# EAGLE schematic PhatStats Slim Enclosure 2.8 ILI9341 QTPY XIAO PCB v1.0c XPT2406  (EAGLE 7.6.0)
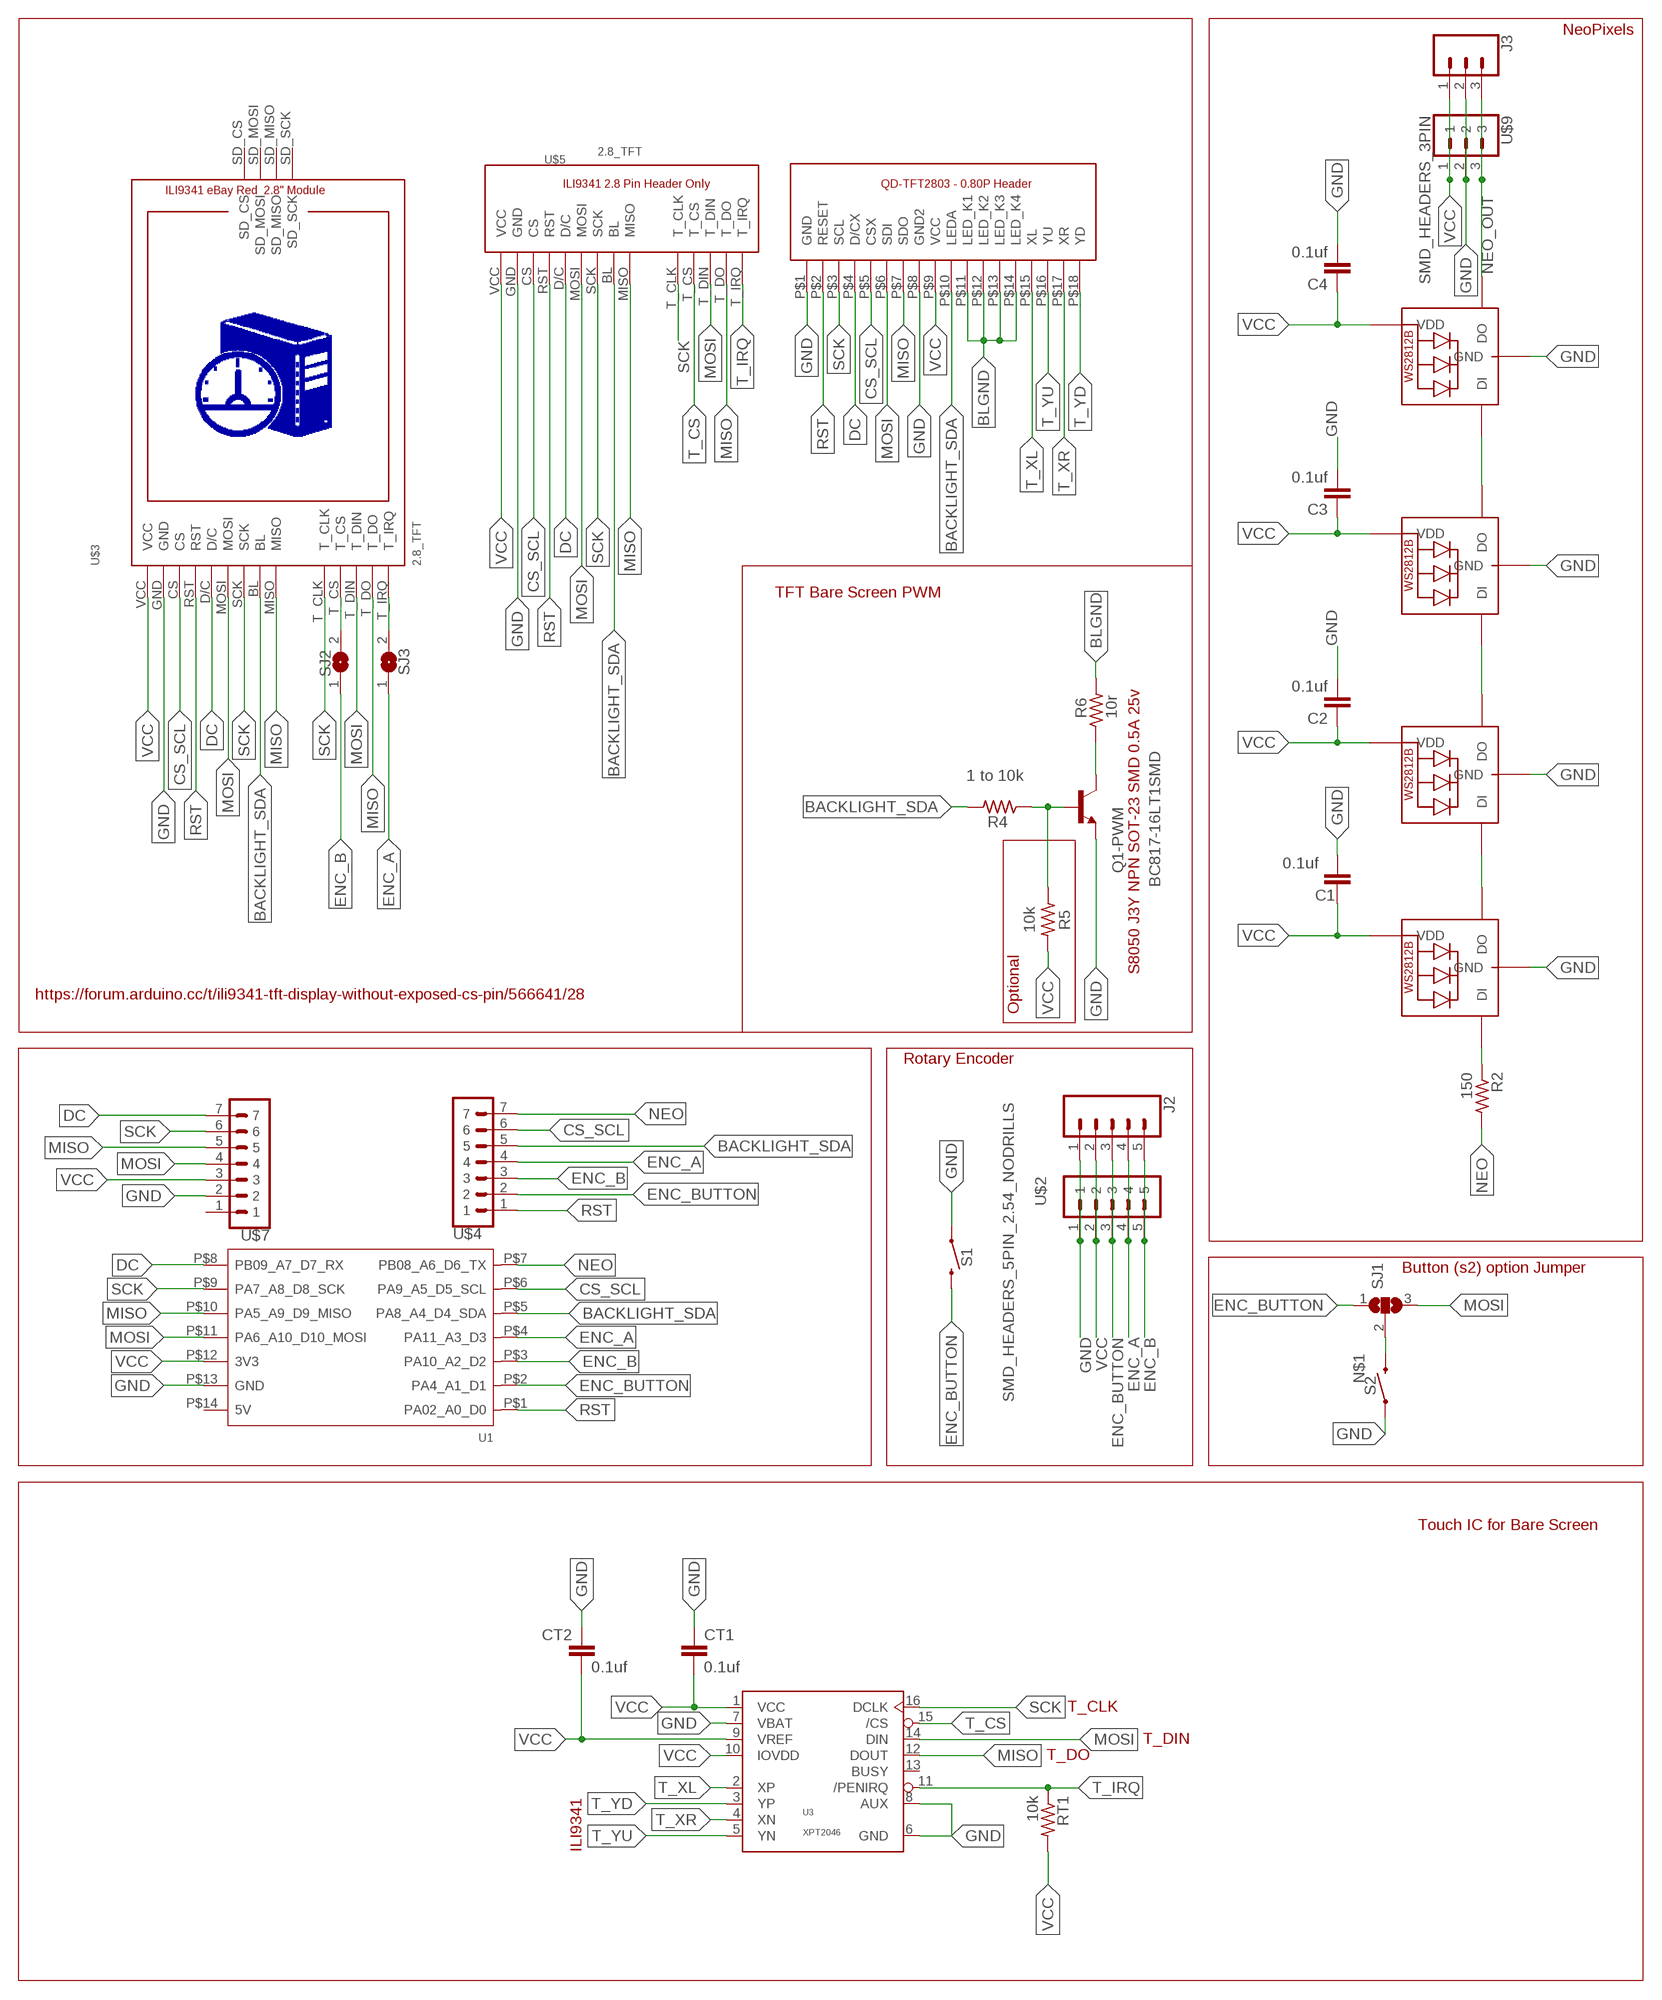
[diagram p0: schematic, sheet 1]

## Parts
0  ILI9341-2.8  [ILI9341-2.8]
C1  0.1uf  C-EUC1206  [C1206]
C2  0.1uf  C-EUC1206  [C1206]
C3  0.1uf  C-EUC1206  [C1206]
C4  0.1uf  C-EUC1206  [C1206]
CT1  0.1uf  C-EUC1206  [C1206]
CT2  0.1uf  C-EUC1206  [C1206]
J2  CONN_05  [1X05]
J3  455-1750-1-ND  CONN_03  [1X03]
NEO0  WS2812B5050  [WS2812B]
NEO1  WS2812B5050  [WS2812B]
NEO2  WS2812B5050  [WS2812B]
NEO3  WS2812B5050  [WS2812B]
Q1-PWM  BC817-16LT1SMD  [SOT23-BEC]
R2  150  R-US_M1206  [M1206]
R4  1 to 10k  R-US_M1206  [M1206]
R5  10k  R-US_M1206  [M1206]
R6  10r  R-US_M1206  [M1206]
RT1  10k  R-US_M1206  [M1206]
S1  MOMENTARY-SWITCH-SPST-SMD-6.2MM-TALL  [TACTILE_SWITCH_SMD_6.2MM_TALL]
S2  MOMENTARY-SWITCH-SPST-SMD-6.2MM-TALL  [TACTILE_SWITCH_SMD_6.2MM_TALL]
SJ1  SJ2W  [SJ_2]
SJ2  SJ  [SJ]
SJ3  SJ  [SJ]
U1  MOUDLE-SEEEDUINO-XIAO  [MOUDLE14P-2.54-21X17.8MM]
U3  XPT2046  [TSSOP-16]
U$2  SMD_HEADERS_5PIN_2.54_NODRILLS  [SMD_HEADERS_5PIN]
U$3  2.8_TFT  [2.8_TFT]
U$4  SMD_HEADERS_7PIN_2.54_NODRILLS  [SMD_HEADERS_7PIN]
U$5  2.8_TFT  [2.8_TFT]
U$7  SMD_HEADERS_7PIN_2.54_NODRILLS  [SMD_HEADERS_7PIN]
U$9  SMD_HEADERS_3PIN  [SMD_HEADERS_3PIN]

## Nets
BACKLIGHT_SDA: 0.P$10(LEDA) R4.2 U1.P$5(PA8_A4_D4_SDA) U$3.BL U$4.5 U$5.BL
BLGND: 0.P$11(LED_K1) 0.P$12(LED_K2) 0.P$13(LED_K3) 0.P$14(LED_K4) R6.2
CS_SCL: 0.P$5(CSX) U1.P$6(PA9_A5_D5_SCL) U$3.CS U$4.6 U$5.CS
DC: 0.P$4(D/CX) U1.P$8(PB09_A7_D7_RX) U$3.D/C U$5.D/C U$7.7
ENC_A: J2.4 SJ3.1 U1.P$4(PA11_A3_D3) U$2.4 U$4.4
ENC_B: J2.5 SJ2.1 U1.P$3(PA10_A2_D2) U$2.5 U$4.3
ENC_BUTTON: J2.3 S1.B2 SJ1.1 U1.P$2(PA4_A1_D1) U$2.3 U$4.2
GND: 0.P$1(GND) 0.P$8(GND2) C1.1 C2.2 C3.2 C4.2 CT1.1 CT2.1 J2.1 J3.2 NEO0.3-GND(GND) NEO1.3-GND(GND) NEO2.3-GND(GND) NEO3.3-GND(GND) Q1-PWM.E S1.A2 S2.A2 U1.P$13(GND) U3.6(GND) U3.7(VBAT) U3.8(AUX) U$2.1 U$3.GND U$5.GND U$7.2 U$9.2
MISO: 0.P$7(SDO) U1.P$10(PA5_A9_D9_MISO) U3.12(DOUT) U$3.MISO U$3.T_DO U$5.MISO U$5.T_DO U$7.5
MOSI: 0.P$6(SDI) SJ1.3 U1.P$11(PA6_A10_D10_MOSI) U3.14(DIN) U$3.MOSI U$3.T_DIN U$5.MOSI U$5.T_DIN U$7.4
N$1: S2.B2 SJ1.2
N$2: Q1-PWM.B R4.1 R5.1
N$3: NEO1.2-DOUT(DO) NEO2.4-DIN(DI)
N$4: NEO0.4-DIN(DI) R2.1
N$5: NEO2.2-DOUT(DO) NEO3.4-DIN(DI)
N$6: Q1-PWM.C R6.1
NEO: R2.2 U1.P$7(PB08_A6_D6_TX) U$4.7
NEO_OUT: J3.3 NEO3.2-DOUT(DO) U$9.3
NEODATA: NEO0.2-DOUT(DO) NEO1.4-DIN(DI)
RST: 0.P$2(RESET) U1.P$1(PA02_A0_D0) U$3.RST U$4.1 U$5.RST
SCK: 0.P$3(SCL) U1.P$9(PA7_A8_D8_SCK) U3.16(DCLK) U$3.SCK U$3.T_CLK U$5.SCK U$5.T_CLK U$7.6
T_CS: SJ2.2 U3.15(/CS) U$3.T_CS U$5.T_CS
T_IRQ: RT1.1 SJ3.2 U3.11(/PENIRQ) U$3.T_IRQ U$5.T_IRQ
T_XL: 0.P$15(XL) U3.2(XP)
T_XR: 0.P$17(XR) U3.4(XN)
T_YD: 0.P$18(YD) U3.3(YP)
T_YU: 0.P$16(YU) U3.5(YN)
VCC: 0.P$9(VCC) C1.2 C2.1 C3.1 C4.1 CT1.2 CT2.2 J2.2 J3.1 NEO0.1-VDD(VDD) NEO1.1-VDD(VDD) NEO2.1-VDD(VDD) NEO3.1-VDD(VDD) R5.2 RT1.2 U1.P$12(3V3) U3.1(VCC) U3.9(VREF) U3.10(IOVDD) U$2.2 U$3.VCC U$5.VCC U$7.3 U$9.1
Unconnected: U1.P$14(5V) U3.13(BUSY) U$3.SD_CS U$3.SD_MISO U$3.SD_MOSI U$3.SD_SCK U$7.1

## Notes on the sheet
- NeoPixels
- TFT Bare Screen PWM
- S8050 J3Y NPN SOT-23 SMD 0.5A 25v
- https://forum.arduino.cc/t/ili9341-tft-display-without-exposed-cs-pin/566641/28
- Optional
- Rotary Encoder
- Button (s2) option Jumper
- Touch IC for Bare Screen
- T_CLK
- T_DIN
- T_DO
- ILI9341

## Library data of the parts
0 = TML_ili9341_0.8Pitch_Header:ILI9341-2.8
C1-C4 CT1 CT2 = rcl:C-EU: CAPACITOR, European symbol
J2 = SparkFun-Connectors:CONN_05: Multi connection point. Often used as Generic Header-pin footprint for 0.1 inch spaced/style header connections On any of the 0.1 inch spaced packages, you can populate with these: Break Away Headers - Straight <https://www.sparkfun.com/products/116> (PRT-00116) Break Away Male Headers - Right Angle <https://www.sparkfun.com/products/553> (PRT-00553) Female Headers <https://www.sparkfun.com/products/115> (PRT-00115) Break Away Headers - Machine Pin <https://www.sparkfun.com/products/117> (PRT-00117) Break Away Female Headers - Swiss Machine Pin <https://www.sparkfun.com/products/743> (PRT-00743) For SCREWTERMINALS and SPRING TERMINALS visit here: Screw Terimnals on SparkFun.com <https://www.sparkfun.com/search/results?term=Screw+Terminals> (5mm/3.5mm/2.54mm spacing) This device is also useful as a general connection point to wire up your design to another part of your project. Our various solder wires solder well into these plated through hole pads. Hook-Up Wire - Assortment (Stranded, 22 AWG) <https://www.sparkfun.com/products/11375> (PRT-11375) Hook-Up Wire - Assortment (Solid Core, 22 AWG) <https://www.sparkfun.com/products/11367> (PRT-11367) View the entire wire category on our website here <https://www.sparkfun.com/categories/141> Special notes: Molex polarized connector foot print use with SKU : PRT-08231 with associated crimp pins and housings. 1MM SMD Version SKU: PRT-10208
J3 = SparkFun-Connectors:CONN_03: Multi connection point. Often used as Generic Header-pin footprint for 0.1 inch spaced/style header connections On any of the 0.1 inch spaced packages, you can populate with these: Break Away Headers - Straight <https://www.sparkfun.com/products/116> (PRT-00116) Break Away Male Headers - Right Angle <https://www.sparkfun.com/products/553> (PRT-00553) Female Headers <https://www.sparkfun.com/products/115> (PRT-00115) Break Away Headers - Machine Pin <https://www.sparkfun.com/products/117> (PRT-00117) Break Away Female Headers - Swiss Machine Pin <https://www.sparkfun.com/products/743> (PRT-00743) Stackable Header - 3 Pin (Female, 0.1") <https://www.sparkfun.com/products/13875> (PRT-13875) For SCREWTERMINALS and SPRING TERMINALS visit here: Screw Terimnals on SparkFun.com <https://www.sparkfun.com/search/results?term=Screw+Terminals> (5mm/3.5mm/2.54mm spacing) This device is also useful as a general connection point to wire up your design to another part of your project. Our various solder wires solder well into these plated through hole pads. Hook-Up Wire - Assortment (Stranded, 22 AWG) <https://www.sparkfun.com/products/11375> (PRT-11375) Hook-Up Wire - Assortment (Solid Core, 22 AWG) <https://www.sparkfun.com/products/11367> (PRT-11367) View the entire wire category on our website here <https://www.sparkfun.com/categories/141> Special notes: Molex polarized connector foot print use with SKU : PRT-08232 with associated crimp pins and housings.; PROD_ID: XXX-00000
NEO0 NEO1-NEO3 = adafruit:WS2812B
Q1-PWM = transistor-npn:BC817*: NPN Transistor
R2 R4-R6 RT1 = resistor:R-US_: RESISTOR, American symbol
S1 S2 = SparkFun-Switches:MOMENTARY-SWITCH-SPST: Momentary Switch (Pushbutton) - SPST Normally-open (NO) SPST momentary switches (buttons, pushbuttons). Variants PTH-12MM - 12mm square, through-hole Momentary Pushbutton Switch - 12mm Square <https://www.sparkfun.com/products/9190> (COM-09190) PTH-6.0MM, PTH-6.0MM-KIT - 6.0mm square, through-hole Mini Pushbutton Switch <https://www.sparkfun.com/products/97> (COM-00097) KIT package intended for soldering kit's - only one side of pads' copper is exposed. PTH-RIGHT-ANGLE-KIT - Right-angle, through-hole Right Angle Tactile Button <https://www.sparkfun.com/products/10791> - Used on SparkFun BigTime Watch Kit <https://www.sparkfun.com/products/11734> SMD-12MM - 12mm square, surface-mount Tactile Button - SMD (12mm) <https://www.sparkfun.com/products/12993> (COM-12993) Used on SparkFun PicoBoard <https://www.sparkfun.com/products/11888> SMD-4.5MM - 4.5mm Square Trackball Switch Used on SparkFun Blackberry Trackballer Breakout <https://www.sparkfun.com/products/13169> SMD-4.6MMX2.8MM - 4.60mm x 2.80mm, surface mount Used on SparkFun SAMD21 Mini Breakout <https://www.sparkfun.com/products/13664> SMD-5.2MM, SMD-5.2-REDUNDANT - 5.2mm square, surface-mount Mini Pushbutton Switch - SMD <https://www.sparkfun.com/products/8720> (COM-08720) Used on Arduino Pro Mini <https://www.sparkfun.com/products/11114> REDUNDANT package connects both switch circuits together SMD-6.0X3.5MM - 6.0 x 3.5mm, surface mount Momentary Reset Switch SMD <https://www.sparkfun.com/products/8229> (COM-08229) SMD-6.2MM-TALL - 6.2mm square, surface mount Tactile Button - SMD (6mm) <https://www.sparkfun.com/products/12992> Used on SparkFun Digital Sandbox <https://www.sparkfun.com/products/12651> SMD-RIGHT-ANGLE - Right-angle, surface mount Used on SparkFun Block for Intel® Edison - Arduino <https://www.sparkfun.com/products/13036>; PROD_ID: SWCH-11966; SF_SKU: COM-12992
SJ1 = jumper:SJ2W: SMD solder JUMPER
SJ2 SJ3 = jumper:SJ: SMD solder JUMPER
U1 = TML_Seeeduino XIAO_QTPY_ThroughHole_ONLY_V1.1:MOUDLE-SEEEDUINO-XIAO
U3 = TML_XPT2046:XPT2046: XPT2046 touch screen controller General Description The XPT2046 is a 4-wire resistive touch screen controller that incorporates a 12-bit 125 kHz sampling SAR type A/D converter. The XPT2046 operates down to 2.2V supply voltage and supports digital I/O interface voltage from 1.5V to VCC in order to connect low voltage uP. The XPT2046 can detect the pressed screen location by performing two A/D conversions. In addition to location, the XPT2046 also measures touch screen pressure.On-chip VREF can be utilized for analog auxiliary input, temperature measurement and battery monitoring withthe ability to measure voltage from 0V to 5V. The XPT2046 also has an on-chip temperature sensor The XPT2046 is available in 16pin QFN thin package(0.75mm in height) and has the operating temperature range of -40°C to +85°C Features 12 bit SAR type A/D converter with S/H circuit Low voltage operation (VCC = 2.2V ∼ 3.6V) Low voltage digital I/F (1.5V ∼ VCC) 4-wire I/F Sampling frequency: 125 kHz (max) On-Chip voltage reference (2.5V) Pen pressure measurement On-chip thermo sensor Direct battery masurement Low power consumption (260μA) Package 16pin QFN Check prices <https://pricing.snapeda.com/parts/XPT2046/Xptek/view-part?ref=eda>; AVAILABILITY: Not in stock; DESCRIPTION: RASPBERRY PI 3.5 TFT DISPLAY; MF: Xptek; MP: XPT2046; PACKAGE: Package; PRICE: None
U$2 = TML_SMD_Headers_2.54_NoDrill:SMD_HEADERS_5PIN_2.54_NODRILLS
U$3 = TML_ili9341-2.8_tft-display_Corrected v2:2.8_TFT: ILI9341 2.8" 2.8 inch TFT SPI Touch Panel 240X320 http://www.lcdwiki.com/2.8inch_SPI_Module_ILI9341_SKU:MSP2807 http://www.lcdwiki.com/Run_Arduino_Demo_in_spi_model
U$4 U$7 = TML_SMD_Headers_2.54_NoDrill:SMD_HEADERS_7PIN_2.54_NODRILLS
U$5 = TML_ili9341-2.8_tft-display_PinHeader only:2.8_TFT: ILI9341 2.8" 2.8 inch TFT SPI Touch Panel 240X320 http://www.lcdwiki.com/2.8inch_SPI_Module_ILI9341_SKU:MSP2807 http://www.lcdwiki.com/Run_Arduino_Demo_in_spi_model
U$9 = TML_SMD_Headers_2.54_NoDrill:SMD_HEADERS_3PIN